# EAGLE design 0802I2CBackpack (EAGLE 8.2.2)
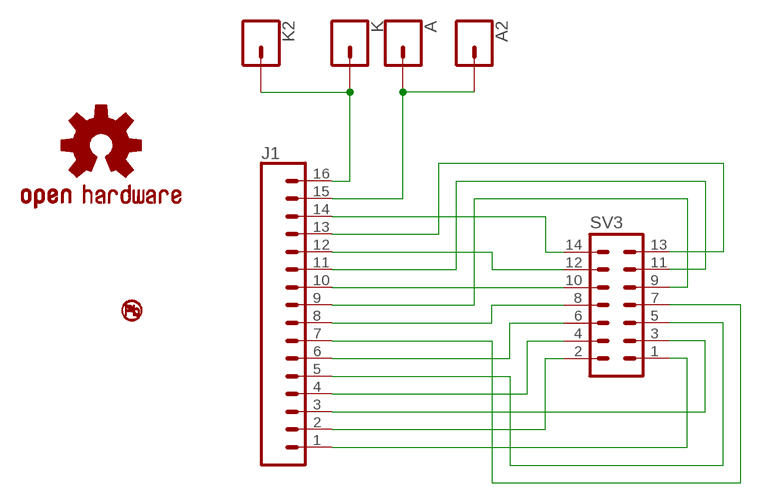
[diagram p0: schematic, sheet 1]

## Parts
A  CONN_01  [1X01]
A2  CONN_01  [1X01]
J1  CONN_16  [1X16]
K  CONN_01  [1X01]
K2  CONN_01  [1X01]
LOGO1  OSHW-LOGOL  [OSHW-LOGO-L]
LOGO2  NO_PB_LOGO  [NO_PB_LOGO_0.120]
SV3  MA07-2  [MA07-2]

## Nets
A: A2.1 A.1 J1.15
D0: J1.7 SV3.7
D1: J1.8 SV3.8
D2: J1.9 SV3.9
D3: J1.10 SV3.10
D4: J1.11 SV3.11
D5: J1.12 SV3.12
D6: J1.13 SV3.13
D7: J1.14 SV3.14
E: J1.6 SV3.6
GND: J1.1 SV3.1
K: J1.16 K2.1 K.1
RS: J1.4 SV3.4
RW: J1.5 SV3.5
V0: J1.3 SV3.3
VDD: J1.2 SV3.2

## Library data of the parts
A A2 K K2 = SparkFun-Connectors:CONN_01: Single connection point. Often used as Generic Header-pin footprint for 0.1 inch spaced/style header connections On any of the 0.1 inch spaced packages, you can populate with these: Break Away Headers - Straight <https://www.sparkfun.com/products/116> (PRT-00116) Break Away Male Headers - Right Angle <https://www.sparkfun.com/products/553> (PRT-00553) Female Headers <https://www.sparkfun.com/products/115> (PRT-00115) Break Away Headers - Machine Pin <https://www.sparkfun.com/products/117> (PRT-00117) Break Away Female Headers - Swiss Machine Pin <https://www.sparkfun.com/products/743> (PRT-00743) This device is also useful as a general connection point to wire up your design to another part of your project. Our various solder wires solder well into these plated through hole pads. Hook-Up Wire - Assortment (Stranded, 22 AWG) <https://www.sparkfun.com/products/11375> (PRT-11375) Hook-Up Wire - Assortment (Solid Core, 22 AWG) <https://www.sparkfun.com/products/11367> (PRT-11367) View the entire wire category on our website here <https://www.sparkfun.com/categories/141> Special notes: SMTSO-256-ET is a "flush mount" nut for a 4-40 screw. We mostly use this on specialty testbeds; it is a nice way to connect hardware to your PCB at an adjustable hieght. Also note, the SNAP packages are for using a snappable style connector. We sell a baggie of snaps and they are also used on two LilyPad designs: Snap Assortment - 30 pack (male and female) <https://www.sparkfun.com/products/11347> (DEV-11347) LilyPad Arduino SimpleSnap <https://www.sparkfun.com/products/10941> (DEV-10941) LilyPad SimpleSnap Protoboard <https://www.sparkfun.com/products/10940> (DEV-10940)
J1 = SparkFun-Connectors:CONN_16: Multi connection point. Often used as Generic Header-pin footprint for 0.1 inch spaced/style header connections On any of the 0.1 inch spaced packages, you can populate with these: Break Away Headers - Straight <https://www.sparkfun.com/products/116> (PRT-00116) Break Away Male Headers - Right Angle <https://www.sparkfun.com/products/553> (PRT-00553) Female Headers <https://www.sparkfun.com/products/115> (PRT-00115) Break Away Headers - Machine Pin <https://www.sparkfun.com/products/117> (PRT-00117) Break Away Female Headers - Swiss Machine Pin <https://www.sparkfun.com/products/743> (PRT-00743) For SCREWTERMINALS and SPRING TERMINALS visit here: Screw Terimnals on SparkFun.com <https://www.sparkfun.com/search/results?term=Screw+Terminals> (5mm/3.5mm/2.54mm spacing) This device is also useful as a general connection point to wire up your design to another part of your project. Our various solder wires solder well into these plated through hole pads. Hook-Up Wire - Assortment (Stranded, 22 AWG) <https://www.sparkfun.com/products/11375> (PRT-11375) Hook-Up Wire - Assortment (Solid Core, 22 AWG) <https://www.sparkfun.com/products/11367> (PRT-11367) View the entire wire category on our website here <https://www.sparkfun.com/categories/141> Special notes: Molex polarized connector foot print use with SKU : PRT-08231 with associated crimp pins and housings. 1MM SMD Version SKU: PRT-10208 NOTES ON THE VARIANTS LOCK and LOCK_LONGPADS... This footprint was designed to help hold the alignment of a through-hole component (i.e. 6-pin header) while soldering it into place. You may notice that each hole has been shifted either up or down by 0.005 of an inch from it's more standard position (which is a perfectly straight line). This slight alteration caused the pins (the squares in the middle) to touch the edges of the holes. Because they are alternating, it causes a "brace" to hold the component in place. 0.005 has proven to be the perfect amount of "off-center" position when using our standard breakaway headers. Although looks a little odd when you look at the bare footprint, once you have a header in there, the alteration is very hard to notice. Also,if you push a header all the way into place, it is covered up entirely on the bottom side.
LOGO1 = SparkFun-Aesthetics:OSHW-LOGO: Open-Source Hardware (OSHW) Logo This logo indicates the piece of hardware it is found on incorporates a OSHW license and/or adheres to the definition of open source hardware found here: http://freedomdefined.org/OSHW
LOGO2 = SparkFun-Aesthetics:NO_PB_LOGO: Lead-Free (No Pb) Logo Logo for lead-safe certified hardware.
SV3 = con-lstb:MA07-2: PIN HEADER; OC_FARNELL: unknown; OC_NEWARK: unknown

## Board
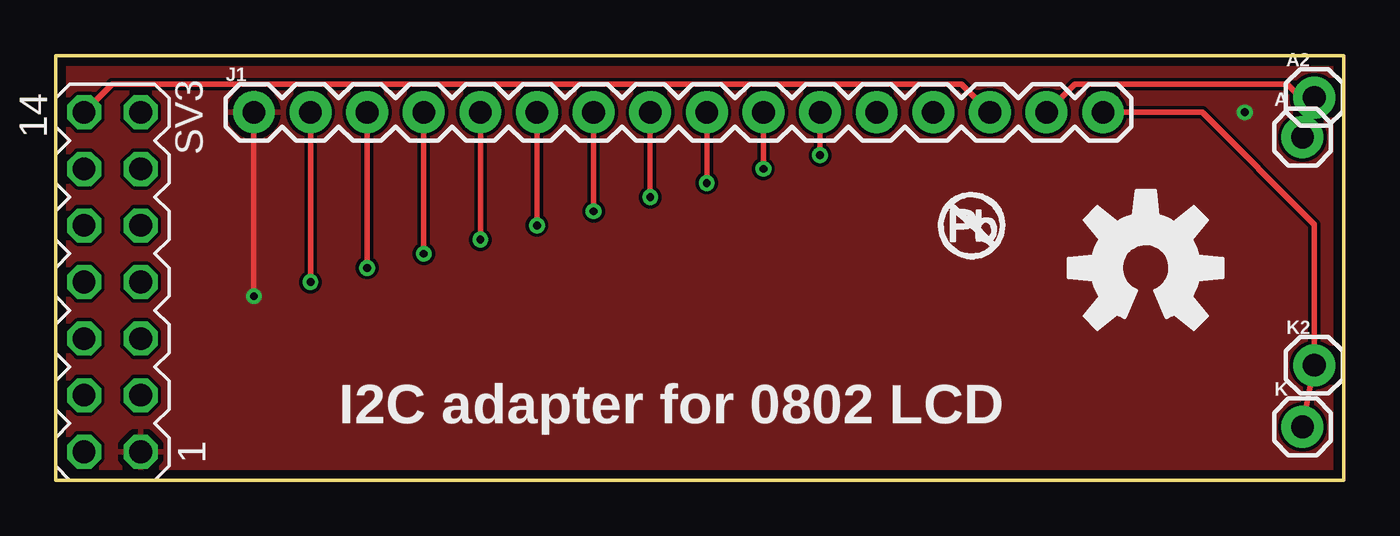
[diagram p1: board, top side]
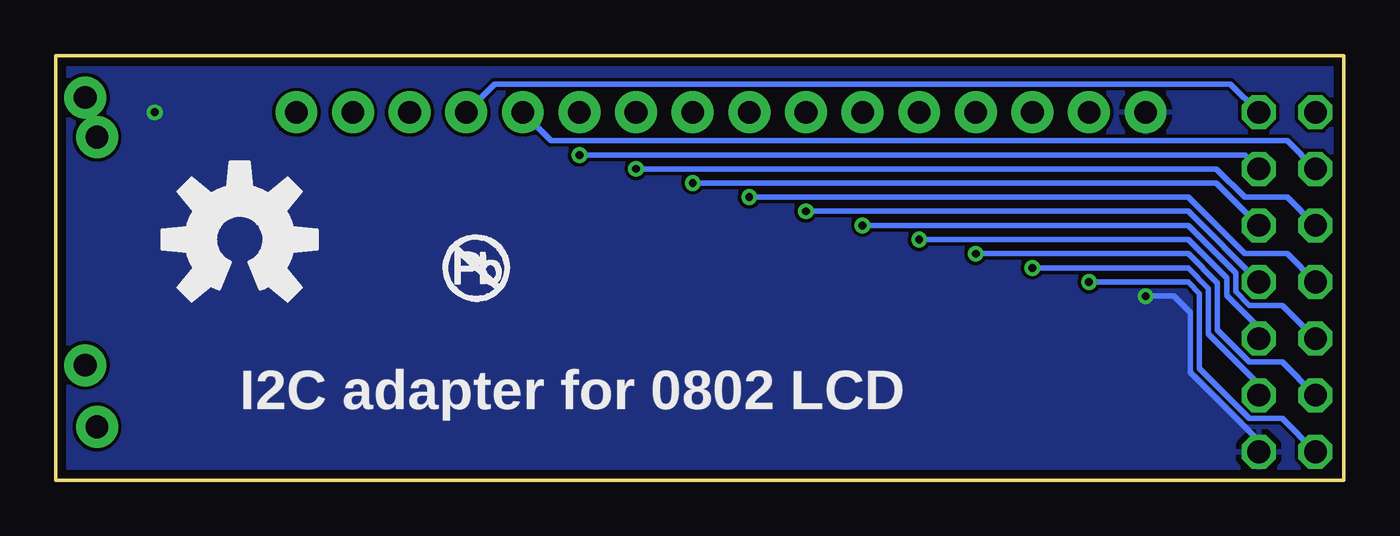
[diagram p2: board, bottom side, seen from below]

Size 57.78 x 19.05 mm. Coordinates in mm from the lower left corner, seen from the top.
Outline: 0,0 57.78,0 57.78,19.05 0,19.05 0,0
Copper layers (1*16): Top 0.0356mm / dielectric 1.5011mm / Bottom 0.0356mm
Design rules "oshpark-2layer": minimum track width 6mil, minimum drill 13mil, track to track 6mil, track to pad 6mil, pad to pad 6mil, via to via 6mil, smd to smd 6mil, copper to edge 15mil, drill to drill 6mil, minimum pad ring 7mil, minimum via ring 7mil, stop-mask expansion 2.5mil, vias tented up to drill 0mil, thermal gap 10mil

### Footprints (pad centres in the part's own frame; a part is rotated, then mirrored left to right if it is on the bottom)
1X01 = drill 1.016 pad 1.88: 1 0,0
1X16 = drill 1.016 pad 1.88: 1 0,0; 2 2.54,0; 3 5.08,0; 4 7.62,0; 5 10.16,0; 6 12.7,0; 7 15.24,0; 8 17.78,0; 9 20.32,0; 10 22.86,0; 11 25.4,0; 12 27.94,0; 13 30.48,0; 14 33.02,0; 15 35.56,0; 16 38.1,0
MA07-2 = drill 1.016 octagon: 1 -7.62,-1.27; 2 -7.62,1.27; 3 -5.08,-1.27; 4 -5.08,1.27; 5 -2.54,-1.27; 6 -2.54,1.27; 7 0,-1.27; 8 0,1.27; 9 2.54,-1.27; 10 2.54,1.27; 11 5.08,-1.27; 12 5.08,1.27; 13 7.62,-1.27; 14 7.62,1.27

### Placement (x,y rotation side)
A  55.93,15.39 0 top
A2  56.46,17.17 0 top
J1  8.89,16.51 0 top
K  55.93,2.39 0 top
K2  56.46,5.16 0 top
LOGO1  48.9,9.53 0 top
LOGO2  39.37,9.53 0 top
LOGO3  NO_PB_LOGO  [NO_PB_LOGO_0.120]  40.64,7.62 0 bottom
LOGO4  OSHW-LOGOL  [OSHW-LOGO-L]  49.53,10.79 0 bottom
SV3  2.54,8.89 90 top

### Tracks (layer width: path | path; a pad name or v marks a point on that pad's centre or on a via)
A
  Top 0.254: A.1 A2.1 55.85,17.17 55.24,17.78 45.72,17.78 J1.15
D0  (via drill 0.35)
  Top 0.254: v24.13,12.06 J1.7
  Bottom 0.254: SV3.7 6.99,12.06 v24.13,12.06
D1  (via drill 0.35)
  Top 0.254: J1.8 v26.67,12.7
  Bottom 0.254: SV3.8 2.54,10.16 4.45,10.16 6.99,12.7 v26.67,12.7
D2  (via drill 0.35)
  Top 0.254: v29.21,13.34 J1.9
  Bottom 0.254: SV3.9 5.71,13.34 v29.21,13.34
D3  (via drill 0.35)
  Top 0.254: v31.75,13.97 J1.10
  Bottom 0.254: SV3.10 2.54,12.7 4.45,12.7 5.71,13.97 v31.75,13.97
D4  (via drill 0.35)
  Top 0.254: v34.29,14.58 J1.11
  Bottom 0.254: SV3.11 4.42,14.58 v34.29,14.58
D5
  Bottom 0.254: SV3.12 2.54,15.24 35.56,15.24 J1.12
D6
  Bottom 0.254: SV3.13 5.08,17.78 38.1,17.78 J1.13
D7
  Top 0.254: SV3.14 2.54,17.78 40.64,17.78 J1.14
E  (via drill 0.35)
  Top 0.254: v21.59,11.43 J1.6
  Bottom 0.254: SV3.6 2.77,7.85 4.24,7.85 4.85,8.46 4.85,9.3 6.99,11.43 v21.59,11.43
GND  (via drill 0.35)
  Top 0.254: J1.1 v8.89,8.26
  Bottom 0.254: v8.89,8.26 7.62,8.26 6.88,7.52 6.88,4.84 3.81,1.76 SV3.1
  other vias: 53.34,16.51
  pour Top: 0,0 0,19.05 57.78,19.05 57.78,0
  pour Bottom: 0,0 0,19.05 57.78,19.05 57.78,0
K
  Top 0.254: K.1 K2.1 56.46,11.48 51.44,16.51 J1.16
RS  (via drill 0.35)
  Top 0.254: v16.51,10.16 J1.4
  Bottom 0.254: 4.04,5.31 4.24,5.31 | 4.04,5.31 2.77,5.31 SV3.4 | 4.24,5.31 4.04,5.31 | 4.24,5.31 5.66,6.73 5.66,8.84 6.99,10.16 v16.51,10.16
RW  (via drill 0.35)
  Top 0.254: J1.5 v19.05,10.79
  Bottom 0.254: SV3.5 3.81,6.84 5.26,8.29 5.26,9.07 6.99,10.79 v19.05,10.79
V0  (via drill 0.35)
  Top 0.254: J1.3 v13.97,9.53
  Bottom 0.254: SV3.3 3.81,4.3 6.07,6.56 6.07,8.61 6.99,9.53 v13.97,9.53
VDD  (via drill 0.35)
  Top 0.254: J1.2 v11.43,8.89
  Bottom 0.254: 3.76,2.77 4.24,2.77 | 3.76,2.77 2.77,2.77 SV3.2 | 4.24,2.77 3.76,2.77 | 4.24,2.77 6.48,5 6.48,8.38 6.99,8.89 v11.43,8.89

### Text on the board
tPlace: I2C adapter for 0802 LCD
bPlace: I2C adapter for 0802 LCD